# EAGLE schematic ee477 (EAGLE 8.6.0)
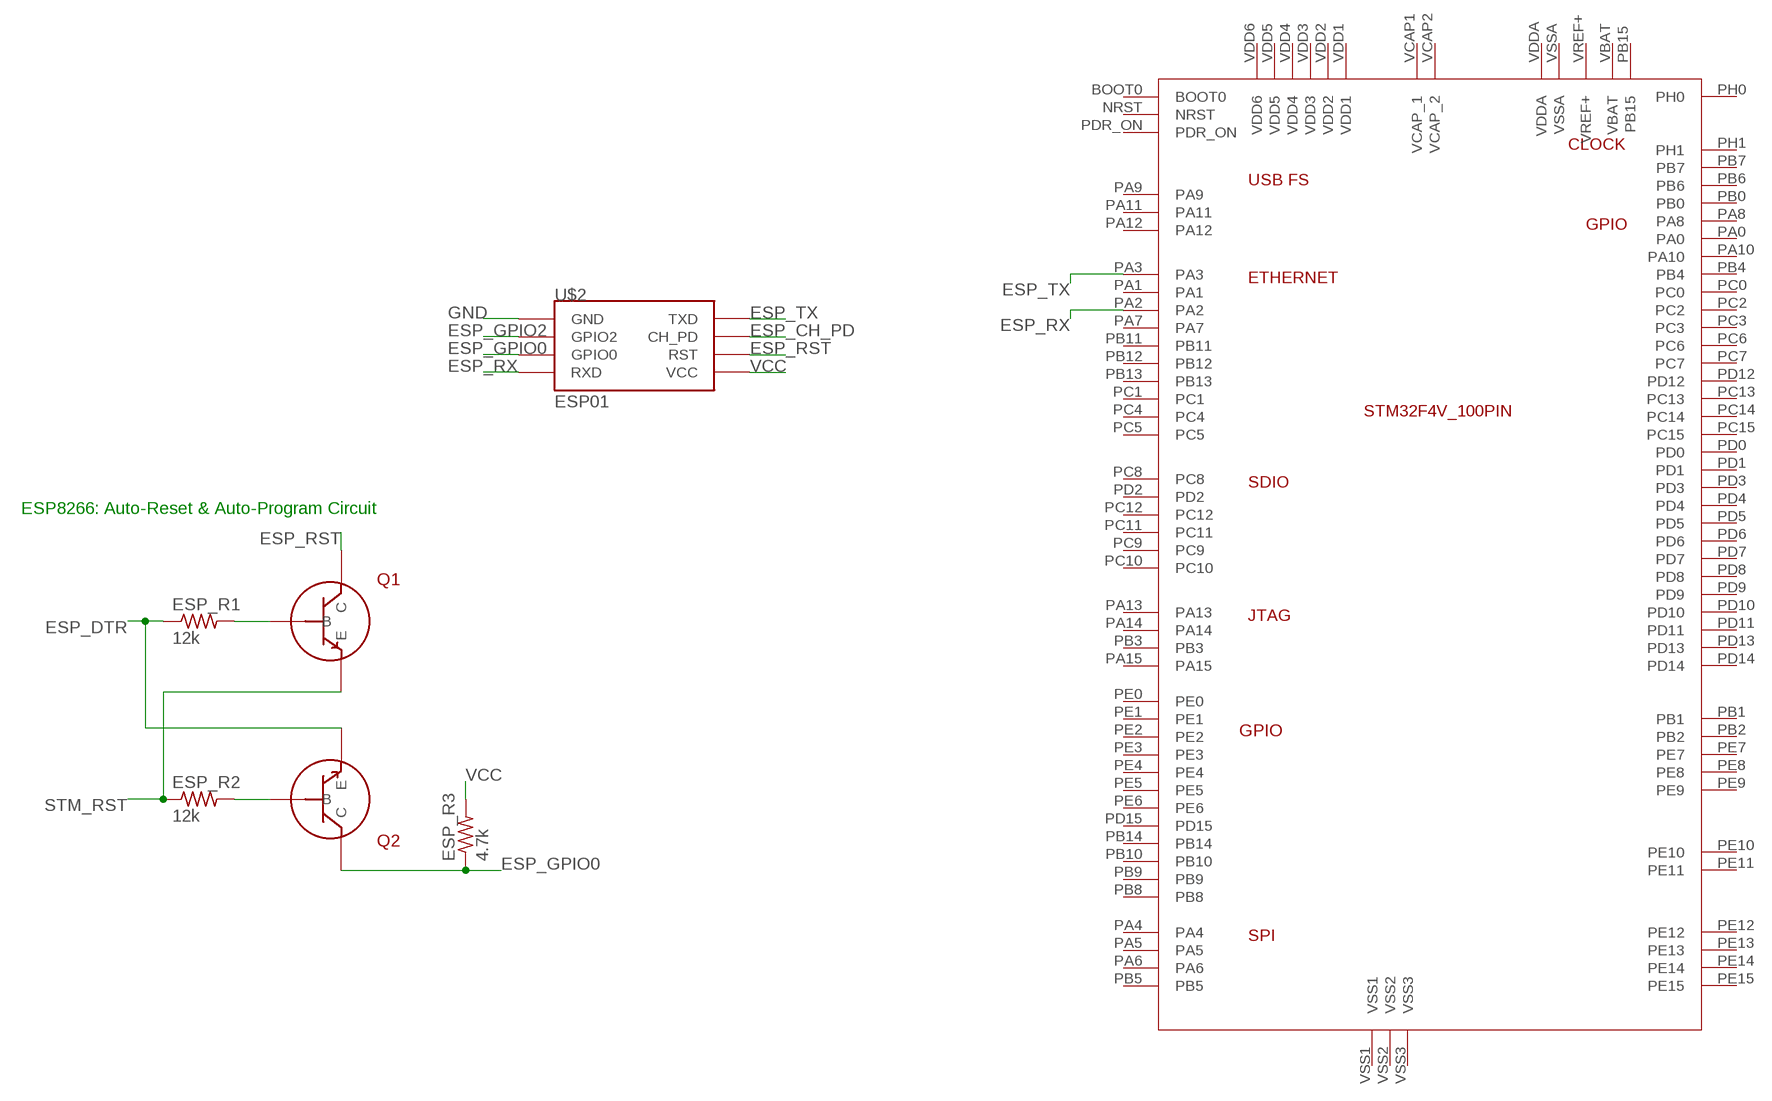
[diagram p0: schematic, sheet 1]

## Parts
ESP_R1  12k  R-US_1812X7R  [1812X7R]
ESP_R2  12k  R-US_1812X7R  [1812X7R]
ESP_R3  4.7k  R-US_1812X7R  [1812X7R]
Q1  BJT_NPN  (no package)
Q2  BJT_NPN  (no package)
U$1  STM32F4V_100PIN_GPSBOARD  [LQFP100]
U$2  ESP01  [ESP01]

## Nets
ESP_CH_PD: U$2.CH_PD
ESP_DTR: ESP_R1.1 Q2.E
ESP_GPIO0: ESP_R3.1 Q2.C U$2.GPIO0
ESP_GPIO2: U$2.GPIO2
ESP_RST: Q1.C U$2.RST
ESP_RX: U$1.PA2 U$2.RX(RXD)
ESP_TX: U$1.PA3 U$2.TX(TXD)
GND: U$2.GND
N$1: ESP_R2.2 Q2.B
N$2: ESP_R1.2 Q1.B
STM_RST: ESP_R2.1 Q1.E
VCC: ESP_R3.2 U$2.VCC
Unconnected: U$1.BOOT0 U$1.NRST U$1.PA0 U$1.PA1 U$1.PA4 U$1.PA5 U$1.PA6 U$1.PA7 U$1.PA8 U$1.PA9 U$1.PA10 U$1.PA11 U$1.PA12 U$1.PA13 U$1.PA14 U$1.PA15 U$1.PB0 U$1.PB1 U$1.PB2 U$1.PB3 U$1.PB4 U$1.PB5 U$1.PB6 U$1.PB7 U$1.PB8 U$1.PB9 U$1.PB10 U$1.PB11 U$1.PB12 U$1.PB13 U$1.PB14 U$1.PB15 U$1.PC0 U$1.PC1 U$1.PC2 U$1.PC3 U$1.PC4 U$1.PC5 U$1.PC6 U$1.PC7 U$1.PC8 U$1.PC9 U$1.PC10 U$1.PC11 U$1.PC12 U$1.PC13 U$1.PC14 U$1.PC15 U$1.PD0 U$1.PD1 U$1.PD2 U$1.PD3 U$1.PD4 U$1.PD5 U$1.PD6 U$1.PD7 U$1.PD8 U$1.PD9 U$1.PD10 U$1.PD11 U$1.PD12 U$1.PD13 U$1.PD14 U$1.PD15 U$1.PDR_ON U$1.PE0 U$1.PE1 U$1.PE2 U$1.PE3 U$1.PE4 U$1.PE5 U$1.PE6 U$1.PE7 U$1.PE8 U$1.PE9 U$1.PE10 U$1.PE11 U$1.PE12 U$1.PE13 U$1.PE14 U$1.PE15 U$1.PH0 U$1.PH1 U$1.VBAT U$1.VCAP1(VCAP_1) U$1.VCAP2(VCAP_2) U$1.VDDA U$1.VREF+ U$1.VSSA

## Notes on the sheet
- ESP8266: Auto-Reset & Auto-Program Circuit

## Power pins joined to a net without a drawn wire
VDD1: U$1.VDD1
VDD2: U$1.VDD2
VDD3: U$1.VDD3
VDD4: U$1.VDD4
VDD5: U$1.VDD5
VDD6: U$1.VDD6
VSS1: U$1.VSS1
VSS2: U$1.VSS2
VSS3: U$1.VSS3

## Library data of the parts
ESP_R1-ESP_R3 = rcl:R-US_: RESISTOR, American symbol; SPICEPREFIX: R
Q1 Q2 = ngspice-simulation:BJT_NPN: Bipolar NPN Transistor
U$1 = stm32f4:STM32F4V_100PIN_GPSBOARD: Custom symbol of 100-pin STM32F407 for GPS RF front-end board. Standard LQFP100 package.
U$2 = esp8266modules:ESP01: ESP8266 Wifi module 01